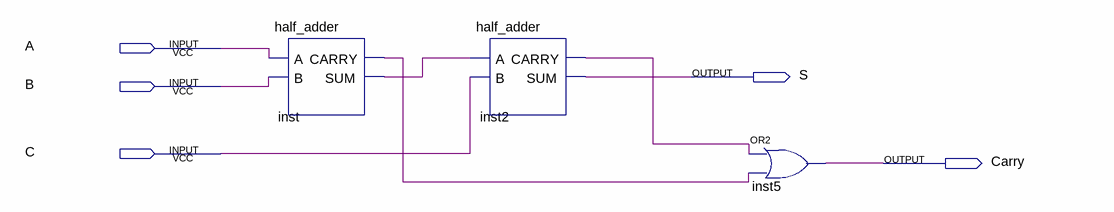
[diagram p0: schematic sheet]
// Quartus schematic full_adder.bdf as structural Verilog: 3 symbols, 5 pins
module full_adder (
  input  A,
  input  B,
  input  C,
  output S,
  output Carry
);

  wire inst2_carry, inst_carry, inst_sum;

  half_adder inst (.A(A), .B(B), .CARRY(inst_carry), .SUM(inst_sum));
  half_adder inst2 (.A(inst_sum), .B(C), .CARRY(inst2_carry), .SUM(S));
  or inst5 (Carry, inst2_carry, inst_carry);
endmodule
